# EasyEDA Pro project esc.eprj

# Schematic Schematic1_1

## Sheets
1 P1: Board Name: Board1_1; Create Date: 2026-05-30; Page Name: P1; Project Name: esc; Schematic Name: Schematic1_1; Update Date: 2026-06-10; Company: EasyEDA.com; Page Size: A4; Version: V1.0
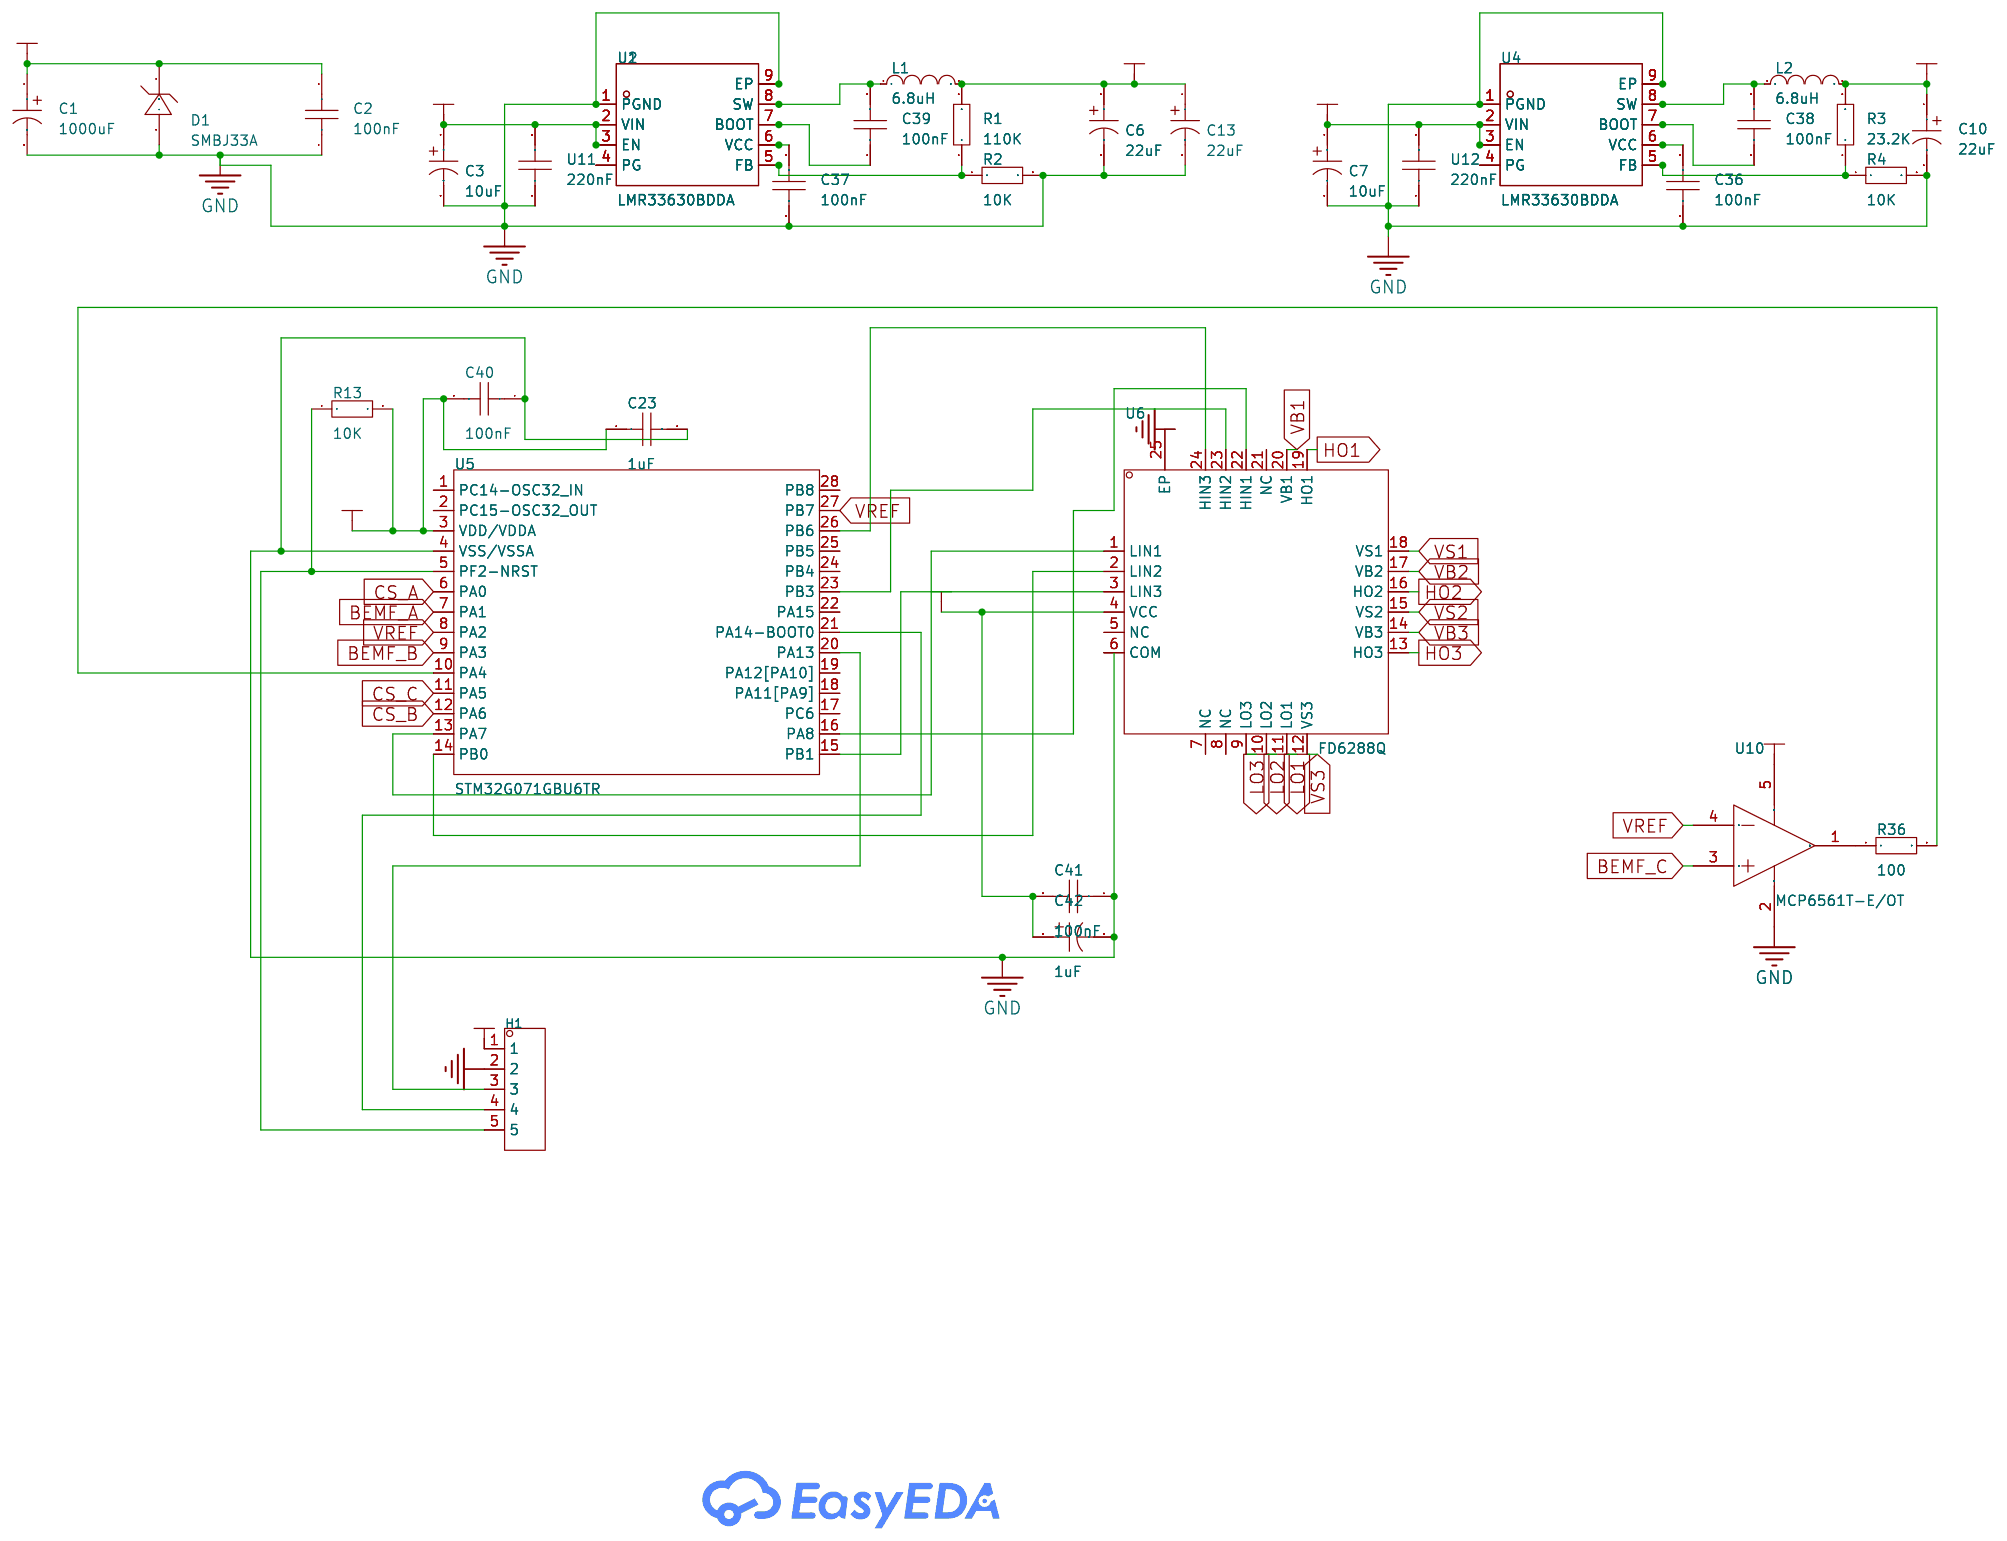
[diagram p0: P1]
2 P2: Page Name: P2; Update Date: 2026-06-04
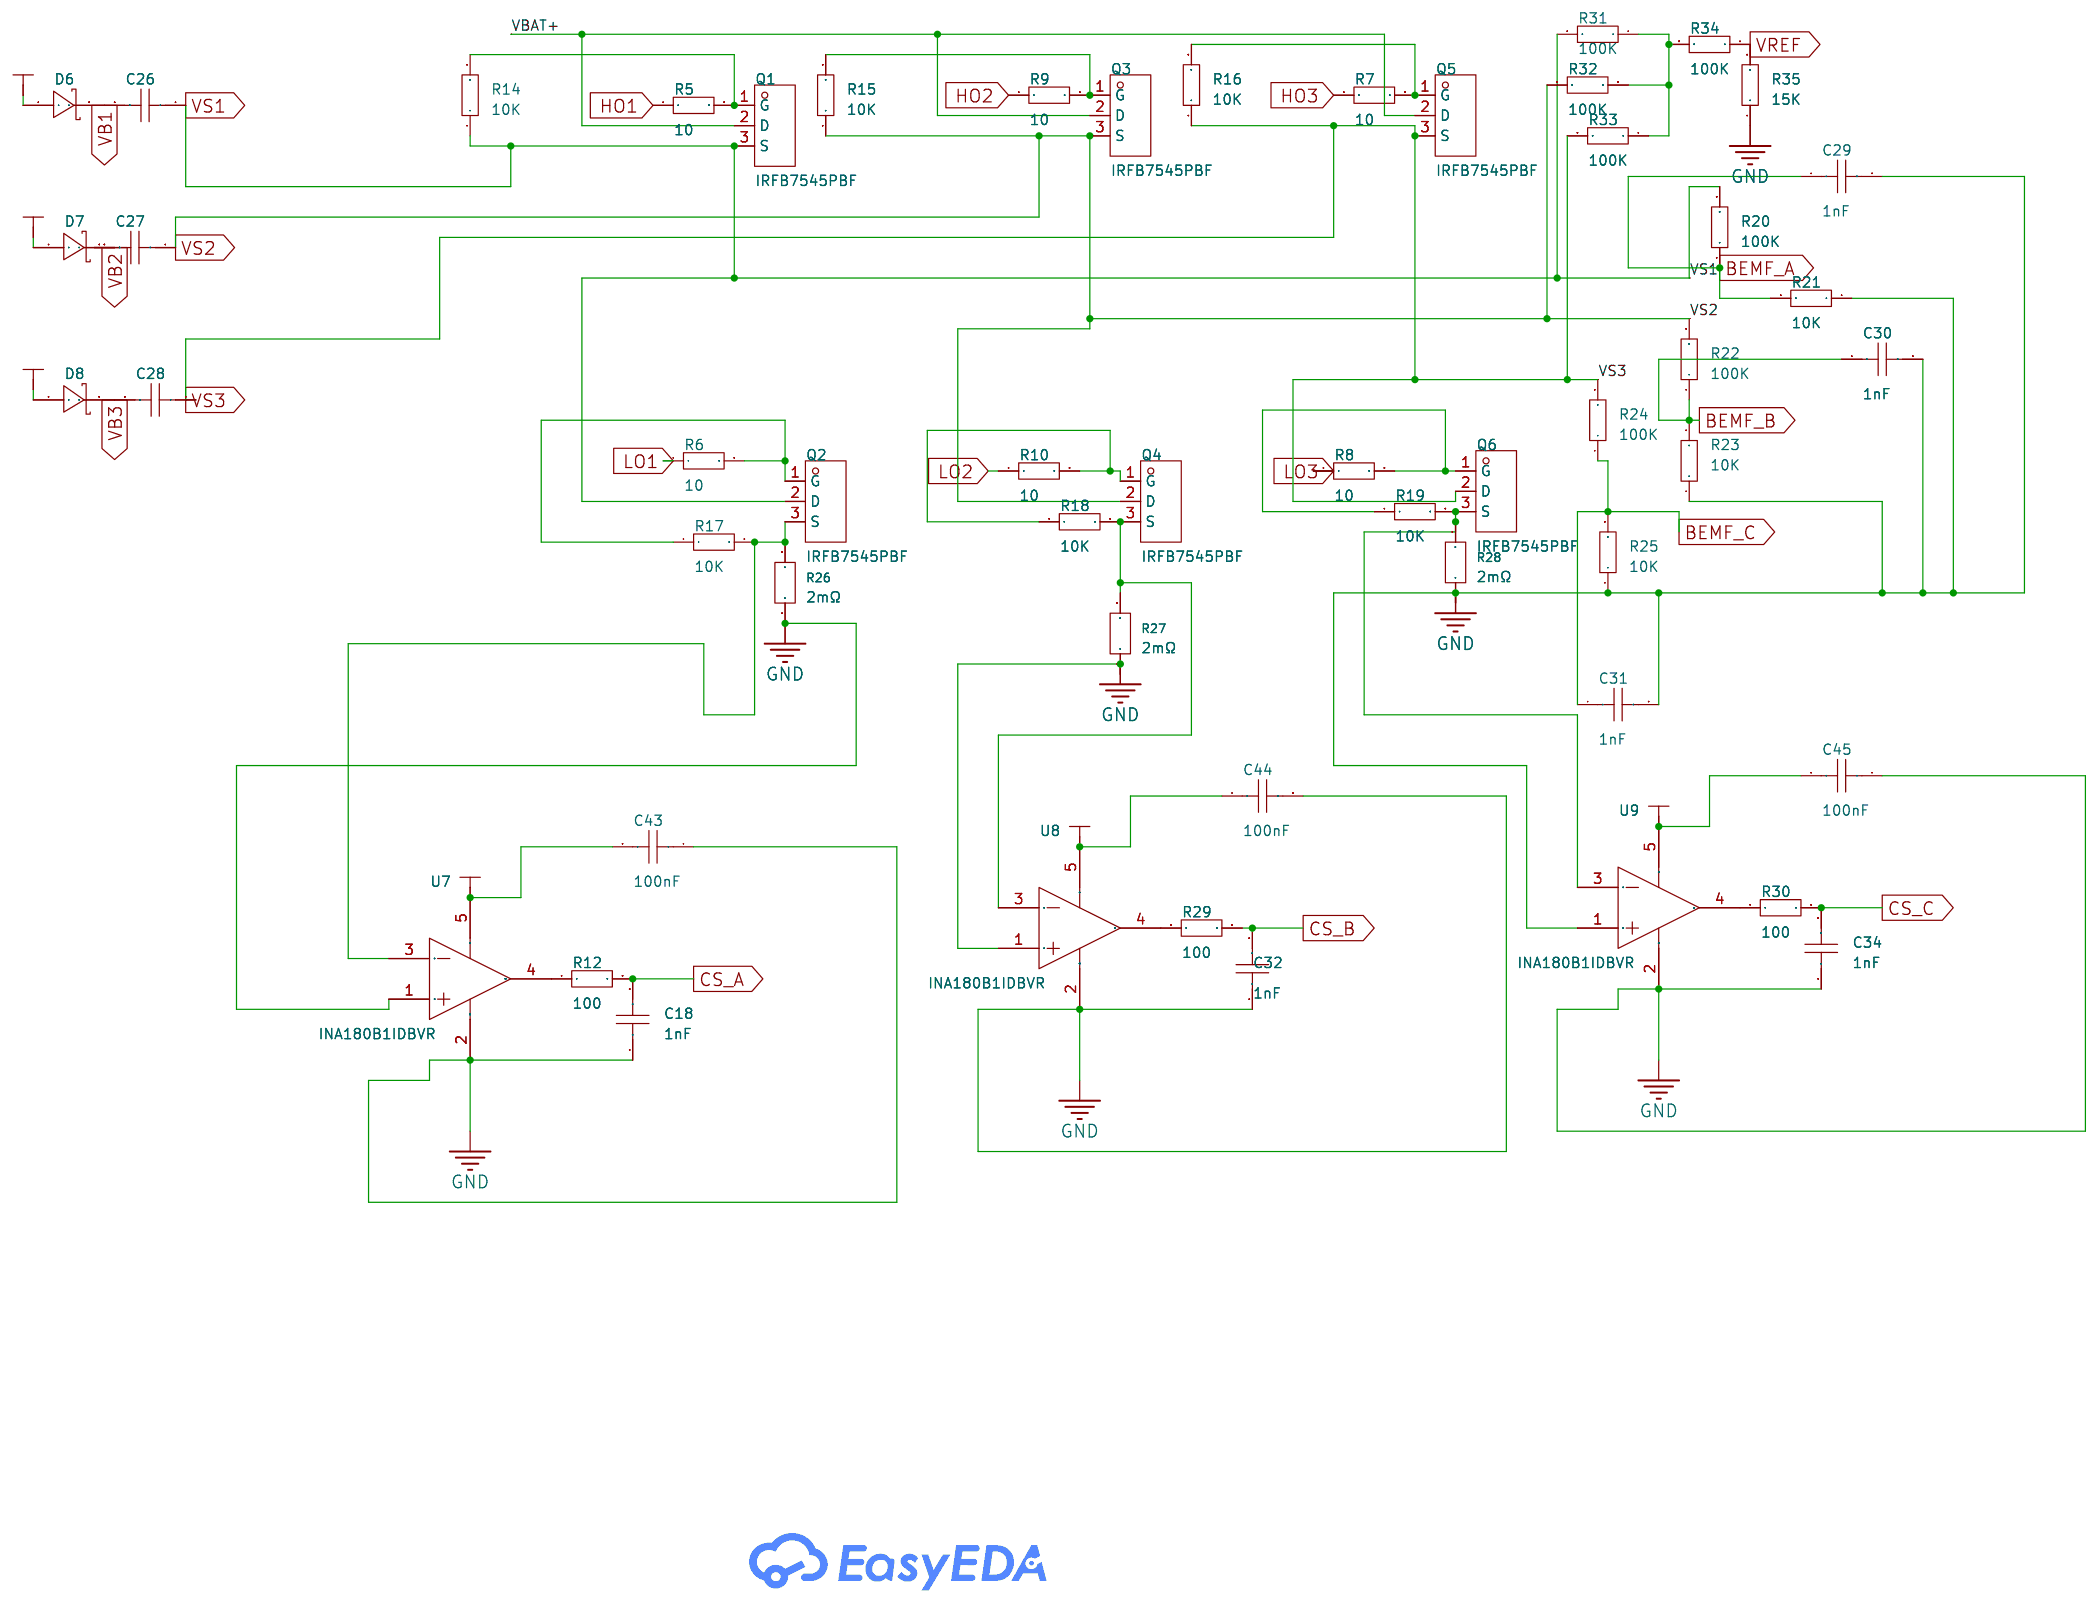
[diagram p1: P2]

## Parts
sheet P1
C1  1000uF  [CAP-TH_BD13.0-P5.00-D0.6-FD]
C2  100nF  [C1111]
C3  10uF  [CAP-TH_BD5.0-P2.00-D0.5-FD-1]
C6  22uF  [CAP-TH_BD5.0-P2.00-D0.5-FD-1]
C7  10uF  [CAP-TH_BD5.0-P2.00-D0.5-FD-1]
C10  22uF  [CAP-TH_BD5.0-P2.00-D0.5-FD-1]
C13  22uF  [CAP-TH_BD5.0-P2.00-D0.5-FD-1]
C23  1uF  [C0603]
C36  100nF  [C0603]
C37  100nF  [C0603]
C38  100nF  [C0603]
C39  100nF  [C0603]
C40  100nF  [C0603]
C41  100nF  [C0603]
C42  1uF  [CAP-TH_BD5.0-P2.00-D0.5-FD_1UF50V5X11GF]
D1  SMBJ33A  [SMB_L4.6-W3.7-LS5.4-RD]
H1  -  [HDR-TH_5P-P2.54-V-M]
L1  6.8uH  [L0603]
L2  6.8uH  [L0603]
R1  110K  [R0603]
R2  10K  [R0603]
R3  23.2K  [R0603]
R4  10K  [R0603]
R13  10K  [R0603]
R36  100  [R0603]
U1  LMR33630BDDA  [POWERPAD-SO-8_L4.9-W3.9-P1.27-LS6.0-BL-EP]
U2  LMR33630BDDA  [POWERPAD-SO-8_L4.9-W3.9-P1.27-LS6.0-BL-EP]
U3  LMR33630BDDA  [POWERPAD-SO-8_L4.9-W3.9-P1.27-LS6.0-BL-EP]
U4  LMR33630BDDA  [POWERPAD-SO-8_L4.9-W3.9-P1.27-LS6.0-BL-EP]
U5  STM32G071GBU6TR  [UFQFPN-28_L4.0-W4.0-P0.50-BL]
U6  FD6288Q  [QFN-24_L4.0-W4.0-P0.50-BL-EP2.6]
U10  MCP6561T-E/OT  [SOT-23-5_L3.0-W1.7-P0.95-LS2.8-BR]
U11  220nF  [CAP-TH_L4.0-W2.5-P2.50-D0.5]
U12  220nF  [CAP-TH_L4.0-W2.5-P2.50-D0.5]
sheet P2
C18  1nF  [C0603]
C26  220nF  [C0805]
C27  220nF  [C0805]
C28  220nF  [C0805]
C29  1nF  [C0603]
C30  1nF  [C0603]
C31  1nF  [C0603]
C32  1nF  [C0603]
C34  1nF  [C0603]
C43  100nF  [C0603]
C44  100nF  [C0603]
C45  100nF  [C0603]
D6  -  [SMA_L4.4-W2.8-LS5.4-R-RD]
D7  -  [SMA_L4.4-W2.8-LS5.4-R-RD]
D8  -  [SMA_L4.4-W2.8-LS5.4-R-RD]
Q1  IRFB7545PBF  [TO-220-3_L10.0-W4.5-P2.54-L]
Q2  IRFB7545PBF  [TO-220-3_L10.0-W4.5-P2.54-L]
Q3  IRFB7545PBF  [TO-220-3_L10.0-W4.5-P2.54-L]
Q4  IRFB7545PBF  [TO-220-3_L10.0-W4.5-P2.54-L]
Q5  IRFB7545PBF  [TO-220-3_L10.0-W4.5-P2.54-L]
Q6  IRFB7545PBF  [TO-220-3_L10.0-W4.5-P2.54-L]
R5  10  [R0603]
R6  10  [R0603]
R7  10  [R0603]
R8  10  [R0603]
R9  10  [R0603]
R10  10  [R0603]
R12  100  [R0603]
R14  10K  [R0603]
R15  10K  [R0603]
R16  10K  [R0603]
R17  10K  [R0603]
R18  10K  [R0603]
R19  10K  [R0603]
R20  100K  [R0603]
R21  10K  [R0603]
R22  100K  [R0603]
R23  10K  [R0603]
R24  100K  [R0603]
R25  10K  [R0603]
R26  2mΩ  [R5930]
R27  2mΩ  [R5930]
R28  2mΩ  [R5930]
R29  100  [R0603]
R30  100  [R0603]
R31  100K  [R0603]
R32  100K  [R0603]
R33  100K  [R0603]
R34  100K  [R0603]
R35  15K  [R0603]
U7  INA180B1IDBVR  [SOT-23-5_L2.9-W1.6-P0.95-LS2.8-BR]
U8  INA180B1IDBVR  [SOT-23-5_L2.9-W1.6-P0.95-LS2.8-BR]
U9  INA180B1IDBVR  [SOT-23-5_L2.9-W1.6-P0.95-LS2.8-BR]

## Library data of the parts
C1 = 50V1000uF CD288: LCSC Part Name: 1000uF ±20% 50V; Supplier Part: C2960425; Manufacturer: HRK(鸿瑞凯电子); Supplier Footprint: 插件,D13xL26mm; JLCPCB Part Class: Extended Part; Datasheet: https://item.szlcsc.com/datasheet/50V1000uF%2520CD288/3347227.html; Supplier: LCSC; Tolerance: ±20%; Voltage Rating: 50V; Pin Spacing: 5mm; Diameter: 13mm; Height - Seated (Max): 26mm; Operating Temperature: -40℃~+105℃
C2 = 200B104MT50XT1K: LCSC Part Name: 100nF 50V; Supplier Part: C3910028; Manufacturer: Kyocera AVX; Supplier Footprint: 1111; JLCPCB Part Class: Extended Part; Datasheet: https://atta.szlcsc.com/upload/public/pdf/source/20240116/CD79800428D4CA8C9D09044DFE1D9B8D.pdf; Supplier: LCSC
C3 C7 = 50V10uF CD110_C2960373: LCSC Part Name: 10uF ±20% 50V; Supplier Part: C2960373; Manufacturer: HRK(鸿瑞凯电子); Manufacturer Part: 50V10uF CD110; Supplier Footprint: 插件,D5xL11mm; JLCPCB Part Class: Extended Part; Datasheet: https://item.szlcsc.com/datasheet/50V10uF%2520CD110/3347175.html; Supplier: LCSC; Tolerance: ±20%; Voltage Rating: 50V; Pin Spacing: 2mm; Diameter: 5mm; Height - Seated (Max): 11mm; Operating Temperature: -40℃~+105℃
C6 C10 C13 = 22UF50VC110GF: LCSC Part Name: 22uF ±20% 50V; Supplier Part: C46867055; Manufacturer: Econd(米朗电子); Supplier Footprint: 插件,D5xL11mm; JLCPCB Part Class: Extended Part; Datasheet: https://item.szlcsc.com/datasheet/22UF50VC110GF/49031920.html; Supplier: LCSC; Tolerance: ±20%; Voltage Rating: 50V; Ripple Current: 180mA@100KHz; Equivalent Series Resistance(ESR): 1Ω; Pin Spacing: 2mm; Diameter: 5mm; Height - Seated (Max): 11mm; Lifetime: 3000hrs@105℃; Operating Temperature: -40℃~+105℃
C18 C23 C29-C32 C34 = CAP_0603: Supplier Footprint: 0603
C36-C41 C43-C45 = CS1608X7R104K500NRB: LCSC Part Name: 100nF 50V; Supplier Part: C2909627; Manufacturer: SAMWHA(三和); Supplier Footprint: 0603; JLCPCB Part Class: Extended Part; Datasheet: https://item.szlcsc.com/datasheet/CS1608X7R104K500NRB/3187513.html; Supplier: LCSC; Voltage Rating: 50V; Temperature Coefficient: X7R
C42 = 1uF50V5x11GF: LCSC Part Name: 1uF ±20% 50V; Supplier Part: C49304893; Manufacturer: Econd(米朗电子); Supplier Footprint: 插件,D5xL11mm; JLCPCB Part Class: Extended Part; Datasheet: https://item.szlcsc.com/datasheet/1uF50V5x11GF/51766721.html; Supplier: LCSC; Tolerance: ±20%; Voltage Rating: 50V; Ripple Current: 25mA@100KHz; Equivalent Series Resistance(ESR): 3.95Ω; Pin Spacing: 2mm; Diameter: 5mm; Height - Seated (Max): 11mm; Lifetime: 2000hrs@105℃; Operating Temperature: -40℃~+105℃
D1 = SMBJ33A_C49242950: LCSC Part Name: 瞬态电压抑制器; Supplier Part: C49242950; Manufacturer: PDW(芯格诺科技); Supplier Footprint: SMB(DO-214AA); JLCPCB Part Class: Extended Part; Datasheet: https://item.szlcsc.com/datasheet/SMBJ33A/51670222.html; Supplier: LCSC; Polarity: Unidirectional; Reverse Stand-Off Voltage (Vrwm): 33V; Clamping Voltage: 53.3V; Peak Pulse Current (Ipp): 11.3A; Peak Pulse Power Dissipation (Ppp): 600W@10/1000us; Voltage - Breakdown: 40.6V; Reverse Leakage Current (Ir): 1uA; Type: TVS
H1 = HDR-M_2.54_1x5P: Supplier Part: C358687; Supplier Footprint: 插件; Pin Structure: 1x5P; Pitch: 2.54mm; Circluar Pins/Square Pins: Square Pins; Mounting Type: Straight; Number of Rows: Plugin; Number of Pins: 5P; Length of Mating Pin: 6mm; Insulation Height: 2.5mm; Length of End Connection Pin: 3mm; Operating Temperature Range: -40℃~+105℃; Color: Black
L1 L2 = L_0603
R1-R10 R12-R25 R29-R36 = Res_0603: Supplier Footprint: 0603
U1-U4 = LMR33630BDDA: LCSC Part Name: 3.8V至36V、3A同步降压转换器; Supplier Part: C1355643; Manufacturer: TI(德州仪器); Supplier Footprint: SO-8; JLCPCB Part Class: Extended Part; Datasheet: https://www.ti.com/cn/lit/gpn/lmr33630; Supplier: LCSC; Function: Buck; Voltage - Supply: 3.8V~36V; Output Voltage: 1V~24V; Output Current: 3A; Frequency - Switching: 1.4MHz; Operating Temperature: -40℃~+125℃@(TJ); Synchronous Rectifier: Yes; Number of Outputs: 1; Topology: Buck; Switch tube (built-in/external): Built-In; Output Type: Adjustable
U5 = STM32G071GBU6TR: LCSC Part Name: 主流Arm Cortex-M0+ MCU，具有128 KB Flash存储器、36 KB RAM、64 MHz CPU、4x USART、定时器、ADC、DAC和通信接口，1.7-3.6V; Supplier Part: C724235; Manufacturer: ST(意法半导体); Supplier Footprint: UFQFPN-28(4x4); JLCPCB Part Class: Extended Part; Datasheet: https://atta.szlcsc.com/upload/public/pdf/source/20200511/C529341_B4645443CFA701032F4478EC9851D5EF.pdf; Supplier: LCSC; CPU Core: ARM-MSeries; CPU Maximum Speed: 64MHz; Program Storage Size: 128KB; Program Memory Type: FLASH; Number of I/O: 26; ADC (Bit): 12bit; DAC (Bit): 12bit; Low Voltage Detection Threshold: 1.7V~3.6V
U6 = FD6288Q_C328453: LCSC Part Name: 三相250V栅极驱动器; Supplier Part: C328453; Manufacturer: Fortior Tech(峰岹); Supplier Footprint: QFN-24-EP(4x4); JLCPCB Part Class: Extended Part; Datasheet: https://item.szlcsc.com/datasheet/FD6288Q/308367.html; Supplier: LCSC; Driven Configuration: Three Phase; Load Type: MOSFET；IGBT; Number of Drivers: 3; Current - Output Low(IOL): 1.8A; Current - Output High(IOH): 1.5A; Voltage - Supply: 5V~20V; Rise Time: 12ns; Fall Time: 12ns; Propagation Delay tpLH: 300ns; Propagation Delay tpHL: 100ns; Features: Under Voltage Protection; Operating Temperature: -40℃~+125℃; Input Logic Level - High: 2.7V; Input Logic Level - Low: 800mV; Quiescent Current(Iq): 330uA
U10 = MCP6561T-E/OT: Supplier Part: C117501; Manufacturer: MICROCHIP(美国微芯); Supplier Footprint: SOT-23-5; JLCPCB Part Class: Extended Part; Datasheet: https://item.szlcsc.com/datasheet/MCP6561T-E%252FOT/118759.html; Supplier: LCSC; Number of Channels: Single channel; Vos - Input Offset Voltage: 3mV; Ib - Input Bias Current: 1pA; Propagation Delay Time: 56ns; Input Hysteresis Voltage (Vhys): 2.5mV; Voltage - Supply: 1.8V~5.5V; Output Type: TTL；CMOS; Rail to Rail: Rail-to-rail input; Quiescent Current per Amplifier: 100uA; Operating Temperature: -40℃~+125℃
U11 U12 = FK18X7R1H224K: LCSC Part Name: 220nF ±10% 50V; Supplier Part: C3692290; Manufacturer: TDK; Supplier Footprint: 插件,P=2.5mm; JLCPCB Part Class: Extended Part; Datasheet: https://item.szlcsc.com/datasheet/FK18X7R1H224K/4260096.html; Supplier: LCSC; Tolerance: ±10%; Voltage Rating: 50V; Temperature Coefficient: X7R
C26-C28 = TCC0805X7R224K500DT: LCSC Part Name: 220nF(224) ±10% 50V; Supplier Part: C282753; Manufacturer: CCTC(三环); Supplier Footprint: 0805; JLCPCB Part Class: Extended Part; Datasheet: https://atta.szlcsc.com/upload/public/pdf/source/20181010/C282753_A6264DC0342099AD82B8D4F51F57D457.pdf; Supplier: LCSC
D6-D8 = SS54: LCSC Part Name: 40V 5A 550mV@5A; Supplier Part: C22452; Manufacturer: MDD; Supplier Footprint: SMA(DO-214AC); JLCPCB Part Class: Basic Part; Datasheet: https://atta.szlcsc.com/upload/public/pdf/source/20190306/C22452_DC5E4F74C3B638F6D8E4C7650D5BF30E.pdf; Supplier: LCSC; Reverse Voltage (Vr): 40V; Average Rectified Current (Io): 5A; Forward Voltage (Vf@If): 550mV@5A
Q1-Q6 = IRFB7545PBF: Number:1 N-Channel Drain to Source Voltage:60V Current - Continuous Drain(Id):95A RDS(on):5.9mΩ@10V Pd - Power Dissipation:125W Gate Threshold Voltage (Vgs(th)):3.7V@100uA Gate Charge(Qg):110nC@10V Input Capacitance(Ciss):4.01nF Reverse Transfer Capacitan; LCSC Part Name: 1个N沟道 耐压:60V 电流:95A; Supplier Part: C2997913; Manufacturer: Infineon(英飞凌); Supplier Footprint: TO-220; JLCPCB Part Class: Extended Part; Datasheet: https://item.szlcsc.com/datasheet/IRFB7545PBF/3471058.html; Supplier: LCSC; Number: 1 N-Channel; Drain to Source Voltage: 60V; Current - Continuous Drain(Id): 95A; RDS(on): 5.9mΩ@10V; Pd - Power Dissipation: 125W; Gate Threshold Voltage (Vgs(th)): 3.7V@100uA; Gate Charge(Qg): 110nC@10V; Input Capacitance(Ciss): 4.01nF; Reverse Transfer Capacitance (Crss@Vds): 230pF; Operating Temperature: -55℃~+175℃
R26-R28 = HolRS5930-5W-2mR-1%: LCSC Part Name: 2mΩ ±1% 5W; Supplier Part: C558638; Manufacturer: Milliohm(毫欧); Supplier Footprint: 5930; JLCPCB Part Class: Extended Part; Datasheet: https://item.szlcsc.com/datasheet/HolRS5930-5W-2mR-1%2525/581897.html; Supplier: LCSC; Type: Alloy Resistor; Tolerance: ±1%; Power(Watts): 5W; Temperature Coefficient: 20ppm/℃~50ppm/℃
U7-U9 = INA180B1IDBVR: Supplier Part: C544664; Manufacturer: TI(德州仪器); Supplier Footprint: SOT-23-5; JLCPCB Part Class: Extended Part; Datasheet: https://www.ti.com/cn/lit/gpn/ina2180; Supplier: LCSC; Number of Channels: 1; Vcm - Common Mode Voltage: 200mV~26V; Gain: 20V/V; Bandwidth: 350kHz; Ib - Input Bias Current: 100nA; Vos - Input Offset Voltage: 25uV; Operating Temperature: -40℃~+125℃; Differential Voltage: -26V~26V; Single Supply: 2.7V~5.5V; Quiescent Current: 197uA; Output Current: 8mA; Input Offset Voltage Drift(Vos TC): 1uV/℃; Input Offset Current(Ios): 50nA; Slew Rate: 2V/us; Common Mode Rejection Ratio (CMRR): 100dB; Noise density(eN): 40nV/√Hz@1kHz

## Nets
+3.3V: C10.1 C23.1 C40.2 C43.2 C44.1 C45.2 H1.1 L2.2 R3.2 R13.2 U5.3(VDD/VDDA) U7.5(VS) U8.5(VS) U9.5(VS) U10.5(VDD)
+12V: C6.1 C7.1 C13.1 C41.2 C42.1 D6.1(A) D7.1(A) D8.1(A) L1.2 R1.2 U3.2(VIN) U3.3(EN) U4.2(VIN) U4.3(EN) U6.4(VCC) U12.2
+25.2V: C1.1 C2.2 C3.1 D1.1(C) U1.2(VIN) U1.3(EN) U2.2(VIN) U2.3(EN) U11.2
GND: C1.2 C2.1 C3.2 C6.2 C7.2 C10.2 C13.2 C18.1 C23.2 C29.2 C30.2 C31.2 C32.1 C34.1 C36.1 C37.1 C40.1 C41.1 C42.2 C43.1 C44.2 C45.1 D1.2(A) H1.2 R2.2 R4.2 R21.1 R23.1 R25.1 R26.1 R27.1 R28.1 R35.1 U1.1(PGND) U1.9(EP) U2.1(PGND) U2.9(EP) U3.1(PGND) U3.9(EP) U4.1(PGND) U4.9(EP) U5.4(VSS/VSSA) U6.6(COM) U6.25(EP) U7.1(IN+) U7.2(GND) U8.1(IN+) U8.2(GND) U9.1(IN+) U9.2(GND) U10.2(VSS) U11.1 U12.1
VBAT+: Q1.2(D) Q3.2(D) Q5.2(D)
BEMF_A: C29.1 R20.1 R21.2 U5.7(PA1)
BEMF_B: C30.1 R22.1 R23.2 U5.9(PA3)
BEMF_C: C31.1 R24.1 R25.2 U10.3(IN+)
CS_A: C18.2 R12.2 U5.6(PA0)
CS_B: C32.2 R29.2 U5.12(PA6)
CS_C: C34.2 R30.2 U5.11(PA5)
HO1: R5.1 U6.19(HO1)
HO2: R9.1 U6.16(HO2)
HO3: R7.1 U6.13(HO3)
LO1: R6.1 U6.11(LO1)
LO2: R10.1 U6.10(LO2)
LO3: R8.1 U6.9(LO3)
VB1: C26.2 D6.2(K) U6.20(VB1)
VB2: C27.2 D7.2(K) U6.17(VB2)
VB3: C28.2 D8.2(K) U6.14(VB3)
VREF: R34.1 R35.2 U5.8(PA2) U5.27(PB7) U10.4(IN-)
VS1: C26.1 Q1.3(S) Q2.2(D) R14.1 R20.2 R31.2 U6.18(VS1)
VS2: C27.1 Q3.3(S) Q4.2(D) R15.1 R22.2 R32.2 U6.15(VS2)
VS3: C28.1 Q5.3(S) Q6.2(D) R16.1 R24.2 R33.2 U6.12(VS3)
Net-(C36-2): C36.2 U3.6(VCC) U4.6(VCC)
Net-(C37-2): C37.2 U1.6(VCC) U2.6(VCC)
Net-(C38-1): C38.1 U3.7(BOOT) U4.7(BOOT)
Net-(C38-2): C38.2 L2.1 U3.8(SW) U4.8(SW)
Net-(C39-1): C39.1 U1.7(BOOT) U2.7(BOOT)
Net-(C39-2): C39.2 L1.1 U1.8(SW) U2.8(SW)
Net-(H1-3): H1.3 U5.20(PA13)
Net-(H1-4): H1.4 U5.21(PA14-BOOT0)
Net-(H1-5): H1.5 R13.1 U5.5(PF2-NRST)
Net-(Q1-1): Q1.1(G) R5.2 R14.2
Net-(Q2-1): Q2.1(G) R6.2 R17.1
Net-(Q2-3): Q2.3(S) R17.2 R26.2 U7.3(IN-)
Net-(Q3-1): Q3.1(G) R9.2 R15.2
Net-(Q4-1): Q4.1(G) R10.2 R18.1
Net-(Q4-3): Q4.3(S) R18.2 R27.2 U8.3(IN-)
Net-(Q5-1): Q5.1(G) R7.2 R16.2
Net-(Q6-1): Q6.1(G) R8.2 R19.1
Net-(Q6-3): Q6.3(S) R19.2 R28.2 U9.3(IN-)
Net-(R1-1): R1.1 R2.1 U1.5(FB) U2.5(FB)
Net-(R3-1): R3.1 R4.1 U3.5(FB) U4.5(FB)
Net-(R12-1): R12.1 U7.4(OUT)
Net-(R29-1): R29.1 U8.4(OUT)
Net-(R30-1): R30.1 U9.4(OUT)
Net-(R31-1): R31.1 R32.1 R33.1 R34.2
Net-(R36-1): R36.1 U10.1(OUT)
Net-(R36-2): R36.2 U5.10(PA4)
Net-(U1-4): U1.4(PG) U2.4(PG)
Net-(U3-4): U3.4(PG) U4.4(PG)
Net-(U5-13): U5.13(PA7) U6.1(LIN1)
Net-(U5-14): U5.14(PB0) U6.2(LIN2)
Net-(U5-15): U5.15(PB1) U6.3(LIN3)
Net-(U5-16): U5.16(PA8) U6.22(HIN1)
Net-(U5-23): U5.23(PB3) U6.23(HIN2)
Net-(U5-26): U5.26(PB6) U6.24(HIN3)

Not connected (* = marked no-connect by the designer): U5 1(PC14-OSC32_IN) 2(PC15-OSC32_OUT) 17(PC6) 18(PA11[PA9]) 19(PA12[PA10]) 22(PA15) 24(PB4) 25(PB5) 28(PB8); U6 5(NC) 7(NC) 8(NC) 21(NC)
